# Altium schematic sheet PowerSwitch.SchDoc
size A4; SheetNumber: 4; SheetTotal: 13
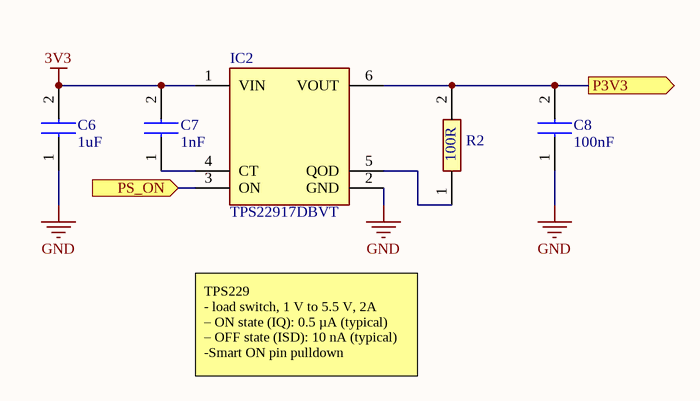
[diagram p0: PowerSwitch.SchDoc]

## Parts
C6  1uF  [CAPC1608X90N]
C7  1nF  [CAPC1005X70N]
C8  100nF  [CAPC1005X70N]
IC2  TPS22917DBVT  [SOT95P280X145-6N]
R2  100R  [RESC1608X55N]

## Ports
P3V3 (out, see Power[4C]), PS_ON (in, see Power[4C])

## Nets
3V3: C6.2 C7.2 IC2.1(VIN)
GND: C6.1 C8.1 IC2.2(GND)
P3V3: C8.2 IC2.6(VOUT) R2.2 ; port P3V3
PS_ON: IC2.3(ON) ; port PS_ON
NetC7_1: C7.1 IC2.4(CT)
NetIC2_5: IC2.5(QOD) R2.1

## Notes on the sheet
- TPS229
  - load switch, 1 V to 5.5 V, 2A
  – ON state (IQ): 0.5 µA (typical)
  – OFF state (ISD): 10 nA (typical)
  -Smart ON pin pulldown
- Title:
- Date:
- Project:
- Type:
- Schematic
- Variant:
- Revision:
- Sheet
- of
- Author:
- Evžen Šteif
- Size:
- A4

## Library data of the parts
C6 = GRM188R61A105KA61D: Capacitor; Manufacturer_Name: Murata Electronics; Datasheet Link: https://search.murata.co.jp/Ceramy/image/img/A01X/G101/ENG/GRM188R61A105KA61-01A.pdf; Height: 0.9mm; Manufacturer_Part_Number: GRM188R61A105KA61D; Mouser Part Number: 81-GRM39R105K10; Mouser Price/Stock: https://www.mouser.co.uk/ProductDetail/Murata-Electronics/GRM188R61A105KA61D?qs=LlFn95tWfDgsujID1PD8Jw%3D%3D; Arrow Part Number: GRM188R61A105KA61D; Arrow Price/Stock: https://www.arrow.com/en/products/grm188r61a105ka61d/murata-manufacturing?region=nac
C7 = GRM155R61A102KA01D: Capacitor; Manufacturer_Name: Murata Electronics; Datasheet Link: https://search.murata.co.jp/Ceramy/image/img/A01X/G101/ENG/GRM155R61A102KA01-01A.pdf; Height: 0.7mm; Manufacturer_Part_Number: GRM155R61A102KA01D; Mouser Part Number: 81-GRM155R61A102KA1D; Mouser Price/Stock: https://www.mouser.co.uk/ProductDetail/Murata-Electronics/GRM155R61A102KA01D?qs=y02iAgv9n635dgph15ru9A%3D%3D; Arrow Part Number: GRM155R61A102KA01D; Arrow Price/Stock: https://www.arrow.com/en/products/grm155r61a102ka01d/murata-manufacturing?region=nac
C8 = GRM155R61A104KA01D: Capacitor; Manufacturer_Name: Murata Electronics; Datasheet Link: https://search.murata.co.jp/Ceramy/image/img/A01X/G101/ENG/GRM155R61A104KA01-02A.pdf; Height: 0.7mm; Manufacturer_Part_Number: GRM155R61A104KA01D; Mouser Part Number: 81-GRM155R61A104KA01; Mouser Price/Stock: https://www.mouser.co.uk/ProductDetail/Murata-Electronics/GRM155R61A104KA01D?qs=5bAuhL3RhmNZw0v59AqOJA%3D%3D; Arrow Part Number: GRM155R61A104KA01D; Arrow Price/Stock: https://www.arrow.com/en/products/grm155r61a104ka01d/murata-manufacturing?utm_currency=USD&region=europe
IC2 = TPS22917DBVT: Integrated Circuit; Manufacturer_Name: Texas Instruments; Datasheet Link: http://www.ti.com/lit/gpn/TPS22917; Height: 1.45mm; Manufacturer_Part_Number: TPS22917DBVT; Mouser Part Number: 595-TPS22917DBVT; Mouser Price/Stock: https://www.mouser.co.uk/ProductDetail/Texas-Instruments/TPS22917DBVT?qs=r5DSvlrkXmJUT8ENVsEqXw%3D%3D; Arrow Part Number: TPS22917DBVT; Arrow Price/Stock: https://www.arrow.com/en/products/tps22917dbvt/texas-instruments?region=nac
R2 = ESR03EZPF1000: Resistor; Manufacturer_Name: ROHM Semiconductor; Datasheet Link: https://componentsearchengine.com//ESR03EZPF1000.pdf; Height: 0.55mm; Manufacturer_Part_Number: ESR03EZPF1000; Mouser Part Number: 755-ESR03EZPF1000; Mouser Price/Stock: https://www.mouser.co.uk/ProductDetail/ROHM-Semiconductor/ESR03EZPF1000?qs=493kPxzlxfJdLkJZpX4ByA%3D%3D